# Altium schematic sheet buffer.SchDoc
size A4
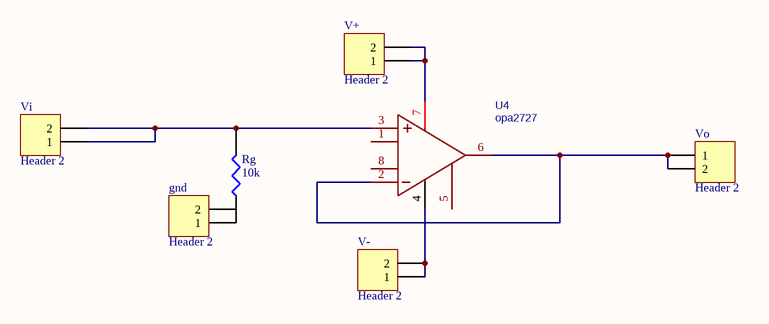
[diagram p0: buffer.SchDoc]

## Parts
gnd  Header 2  [SIP2]
Rg  10k  [AXIAL0.4]
U4  opa2727  [DIP8]
V+  Header 2  [SIP2]
V-  Header 2  [SIP2]
Vi  Header 2  [SIP2]
Vo  Header 2  [SIP2]

## Nets
Netgnd_1: gnd.1 Rg.1
NetRg_2: Rg.2 U4.3(+IN) Vi.1 Vi.2
NetU4_2: U4.2(-IN) U4.6(OUTPUT) Vo.1 Vo.2
NetU4_4: U4.4(-VS) V-.1 V-.2
NetU4_7: U4.7(+VS) V+.1 V+.2

Not connected (* = marked no-connect by the designer): gnd 2; U4 1(RG) 5(REF) 8(RG)

## Library data of the parts
gnd V+ V- Vi Vo = Header 2: Header, 2-Pin; LatestRevisionDate: 17-Jul-2002; LatestRevisionNote: Re-released for DXP Platform.; Publisher: Altium Limited
Rg = RES1
U4 = AD620ANZ: BOM_Manufacturer: ADI; spicePre: X; BOM_Supplier: LCSC; BOM_Manufacturer Part: AD620ANZ; BOM_Supplier Part: C9680; BOM_JLCPCB Part Class: Extended Part; spiceSymbolName: AD620ANZ